# Altium schematic sheet SCH2_Power.SchDoc: Airsoft FAN Controller
size A4
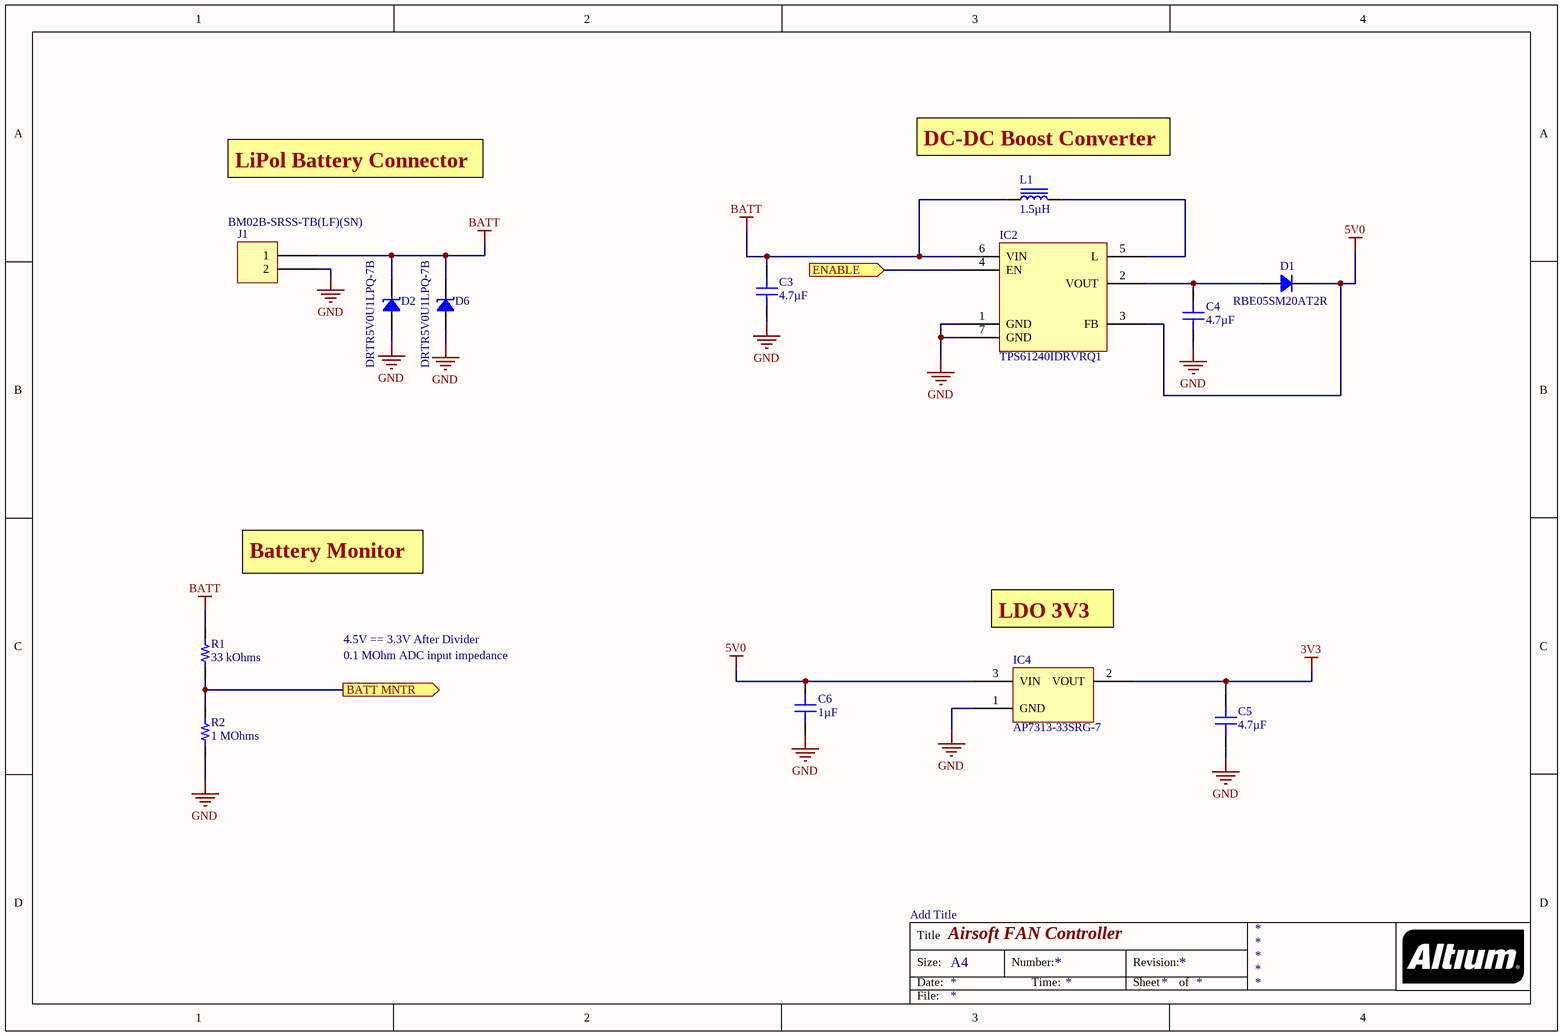
[diagram p0: SCH2_Power.SchDoc]

## Parts
C3  4.7µF  [CAP 0402_1005]
C4  4.7µF  [CAP 0402_1005]
C5  4.7µF  [CAP 0402_1005]
C6  1µF  [CAP 0402_1005]
D1  RBE05SM20AT2R  [SOD-523]
D2  DRTR5V0U1LPQ-7B  [0402]
D6  DRTR5V0U1LPQ-7B  [0402]
IC2  TPS61240IDRVRQ1  [TI WSON-6 DRV0006D 2x2MM]
IC4  AP7313-33SRG-7  [DIODES SOT-23-3]
J1  BM02B-SRSS-TB(LF)(SN)  [MOLX-53398-0271_V]
L1  1.5µH  [IND 0806_2016]
R1  33 kOhms  [RES 0402_1005]
R2  1 MOhms  [RES 0402_1005]

## Ports
BATT MNTR (out), ENABLE (in)

## Nets
3V3: C5.2 IC4.2(VOUT)
5V0: C6.2 D1.2 IC2.3(FB) IC4.3(VIN)
BATT: C3.2 D2.2 D6.2 IC2.6(VIN) J1.1 L1.1 R1.2
GND: C3.1 C4.1 C5.1 C6.1 D2.1 D6.1 IC2.1(GND) IC2.7(GND) IC4.1(GND) J1.2 R2.1
BATT MNTR: R1.1 R2.2 ; port BATT MNTR
ENABLE: IC2.4(EN) ; port ENABLE
NetC4_2: C4.2 D1.1 IC2.2(VOUT)
NetIC2_5: IC2.5(L) L1.2

## Notes on the sheet
- LiPol Battery Connector
- (near L1) DC-DC Boost Converter 5V0
- Battery Monitor
- 4.5V == 3.3V After Divider
- LDO 3V3
- 0.1 MOhm ADC input impedance
- Add Title
- Title
- Size:
- Date:
- A4
- Number:
- Time:
- Revision:
- Sheet
- of
- File:

## Library data of the parts
C3-C5 = C1005X5R1A475K050BC: CAP CER 4.7UF 10V X5R 0402; Manufacturer: TDK Corporation; Tolerance: ±10%; Part Number: C1005X5R1A475K050BC; Value: 4.7µF; Applications: General Purpose; Capacitance: 4.7µF; ComponentLink1Description: Datasheet; ComponentLink1URL: https://product.tdk.com/info/en/catalog/datasheets/mlcc_commercial_general_en.pdf?ref_disty=digikey; ComponentLink2Description: DigiKey Link; ComponentLink2URL: http://digikey.com/product-detail/en/tdk-corporation/C1005X5R1A475K050BC/445-13820-1-ND/3955486; Device Package: 0402 (1005 Metric); Features: Low ESL; LastUpdated: 9/2/2020 1:02:25 AM; Lifecycle Status: Active; Minimum Order: 1; Mounting Type: Surface Mount, MLCC; Operating Temperature: -55°C ~ 85°C; Package / Case: 0402 (1005 Metric); Packaging: TapeAndReel; PartId: 1759; Part Status: Active; Price: 0.10; Series: C; Size / Dimension: 0.039" L x 0.020" W (1.00mm x 0.50mm); Supplier 1: DigiKey; Supplier Part Number 1: 445-13820-1-ND; Temperature Coefficient: X5R; Thickness (Max): 0.022" (0.55mm); Voltage - Rated: 10V
C6 = JMK105C6105KV-F: CAP CER 1UF 6.3V X6S 0402; Manufacturer: Taiyo Yuden; Tolerance: ±10%; Part Number: JMK105C6105KV-F; Value: 1µF; Applications: General Purpose; Capacitance: 1µF; ComponentLink1Description: Datasheet; ComponentLink1URL: https://www.yuden.co.jp/productdata/catalog/mlcc01_e.pdf; ComponentLink2Description: DigiKey Link; ComponentLink2URL: http://digikey.com/product-detail/en/taiyo-yuden/JMK105C6105KV-F/587-3381-1-ND/4157200; Device Package: 0402 (1005 Metric); LastUpdated: 9/2/2020 1:01:39 AM; Lifecycle Status: Active; Minimum Order: 1; Mounting Type: Surface Mount, MLCC; Operating Temperature: -55°C ~ 105°C; Package / Case: 0402 (1005 Metric); Packaging: TapeAndReel; PartId: 12563; Part Status: Active; Price: 0.01; Series: M; Size / Dimension: 0.039" L x 0.020" W (1.00mm x 0.50mm); Supplier 1: DigiKey; Supplier Part Number 1: 587-3381-1-ND; Temperature Coefficient: X6S; Thickness (Max): 0.022" (0.55mm); Voltage - Rated: 6.3V
D1 = RBE05SM20AT2R: DIODE SCHOTTKY 20V 500MA EMD2; Manufacturer: Rohm Semiconductor; Current - Reverse Leakage @ Vr: 150µA @ 20V; Speed: Fast Recovery =< 500ns, > 200mA (Io); Voltage - Forward (Vf) (Max) @ If: 530mV @ 500mA; Part Number: RBE05SM20AT2R; ComponentLink1Description: Datasheet; ComponentLink1URL: https://www.rohm.com/datasheet/RBE05SM20A/rbe05sm20at2r-e; ComponentLink2Description: DigiKey Link; ComponentLink2URL: http://digikey.com/product-detail/en/rohm-semiconductor/RBE05SM20AT2R/RBE05SM20AT2RTR-ND/5721257; Current - Average Rectified (Io): 500mA; Diode Type: Schottky; LastUpdated: 9/2/2020 1:23:19 AM; Lifecycle Status: Active; Minimum Order: 0; Mounting Type: Surface Mount; Operating Temperature - Junction: 150°C (Max); Package / Case: SC-79, SOD-523; Packaging: TapeAndReel; PartId: 2802; Part Status: Active; Price: 0.05; Series: -; Supplier 1: DigiKey; Supplier Part Number 1: RBE05SM20AT2RTR-ND; Supplier Device Package: EMD2; Voltage - DC Reverse (Vr) (Max): 20V
D2 D6 = DRTR5V0U1LPQ-7B: DATALINE PROTECT PP X1-DFN1006-2; Manufacturer: Diodes Incorporated; Capacitance @ Frequency: 1pF @ 1MHz; Current - Peak Pulse (10/1000µs): 5A (8/20µs); Power Line Protection: No; Type: Zener; Unidirectional Channels: 1; Voltage - Breakdown (Min): 6V; Voltage - Clamping (Max) @ Ipp: 10V; Voltage - Reverse Standoff (Typ): 5.5V (Max); Part Number: DRTR5V0U1LPQ-7B; Applications: Automotive; ComponentLink1Description: Datasheet; ComponentLink1URL: https://www.diodes.com/assets/Datasheets/DRTR5V0U1LPQ.pdf; ComponentLink2Description: DigiKey Link; ComponentLink2URL: http://digikey.com/product-detail/en/diodes-incorporated/DRTR5V0U1LPQ-7B/31-DRTR5V0U1LPQ-7BCT-ND/10674185; Device Package: 0402 (1006 Metric); LastUpdated: 9/2/2020 1:28:45 AM; Lifecycle Status: Active; Minimum Order: 1; Mounting Type: Surface Mount; Operating Temperature: -55°C ~ 150°C (TJ); Package / Case: 0402 (1006 Metric); Packaging: Unknown; PartId: 10375; Part Status: Active; Price: 0.04; Series: Automotive, AEC-Q101; Supplier 1: DigiKey; Supplier Part Number 1: 31-DRTR5V0U1LPQ-7BCT-ND; Supplier Device Package: X1-DFN1006-2
IC2 = TPS61240IDRVRQ1: IC REG BOOST 5V 500MA 6SON; Manufacturer: Texas Instruments; Current - Output: 500mA (Switch); Frequency - Switching: 3.5MHz; Function: Step-Up; Number of Outputs: 1; Output Configuration: Positive; Output Type: Fixed; Synchronous Rectifier: Yes; Voltage - Input (Max): 5.5V; Voltage - Input (Min): 2.3V; Part Number: TPS61240IDRVRQ1; ComponentLink1Description: Datasheet; ComponentLink1URL: http://www.ti.com/general/docs/suppproductinfo.tsp?distId=10&gotoUrl=http%3A%2F%2Fwww.ti.com%2Flit%2Fgpn%2Ftps61240-q1; ComponentLink2Description: DigiKey Link; ComponentLink2URL: http://digikey.com/product-detail/en/texas-instruments/TPS61240IDRVRQ1/296-28184-1-ND/2522312; LastUpdated: 9/13/2020 11:04:11 AM; Lifecycle Status: Active; Minimum Order: 1; Mounting Type: Surface Mount; Operating Temperature: -40°C ~ 85°C (TA); Package / Case: 6-WDFN Exposed Pad; Packaging: TapeAndReel; Part Status: Active; Price: 0.73; Series: Automotive, AEC-Q100; Supplier 1: DigiKey; Supplier Part Number 1: 296-28184-1-ND; Supplier Device Package: 6-SON (2x2); Topology: Boost; Voltage - Output (Min/Fixed): 5V
IC4 = AP7313-33SRG-7: IC REG LIN 3.3V 150MA SOT23R-3; Manufacturer: Diodes Incorporated; Current - Quiescent (Iq): 75µA; Current - Supply (Max): 85µA; Number of Regulators: 1; Output Configuration: Positive; Output Type: Fixed; Protection Features: Over Current, Over Temperature, Short Circuit; PSRR: 65dB (100Hz); Voltage Dropout (Max): 0.3V @ 150mA; Voltage - Input (Max): 6V; Part Number: AP7313-33SRG-7; ComponentLink1Description: Datasheet; ComponentLink1URL: https://www.diodes.com/assets/Datasheets/AP7313.pdf; ComponentLink2Description: DigiKey Link; ComponentLink2URL: http://digikey.com/product-detail/en/diodes-incorporated/AP7313-33SRG-7/AP7313-33SRG-7DICT-ND/2270841; Current - Output: 150mA; LastUpdated: 9/2/2020 1:24:50 AM; Lifecycle Status: Active; Minimum Order: 1; Mounting Type: Surface Mount; Operating Temperature: -40°C ~ 85°C; Package / Case: TO-236-3, SC-59, SOT-23-3; Packaging: TapeAndReel; Part Status: Active; Price: 0.09; Series: -; Supplier 1: DigiKey; Supplier Part Number 1: AP7313-33SRG-7DICT-ND; Supplier Device Package: SOT-23R-3; Voltage - Output (Min/Fixed): 3.3V
J1 = BM02B-SRSS-TB(LF)(SN): CONN HEADER SMD 2POS 1MM; Manufacturer: JST Sales America Inc.; Current Rating (Amps): 0.7A; Material Flammability Rating: UL94 V-0; Number of Positions: 2; Number of Positions Loaded: All; Pitch - Mating: 0.039" (1.00mm); Shrouding: Shrouded - 4 Wall; Style: Board to Cable/Wire; Voltage Rating: 50V; Part Number: BM02B-SRSS-TB(LF)(SN); ComponentLink1Description: Datasheet; ComponentLink1URL: http://www.jst-mfg.com/product/pdf/eng/eSR.pdf; ComponentLink2Description: DigiKey Link; ComponentLink2URL: http://digikey.com/product-detail/en/jst-sales-america-inc/BM02B-SRSS-TB-LF-SN/455-1788-1-ND/926859; Connector Type: Header; Contact Finish - Mating: Tin; Contact Finish - Post: Tin; Contact Material: Copper Alloy; Contact Shape: Square; Contact Type: Male Pin; Fastening Type: Push-Pull; Features: Solder Retention; Insulation Color: Natural; Insulation Height: 0.167" (4.25mm); Insulation Material: Polyamide (PA), Nylon; LastUpdated: 1/12/2020 10:11:04 PM; Lifecycle Status: Active; Minimum Order: 1; Mounting Type: Surface Mount; Number of Rows: 1; Operating Temperature: -25°C ~ 85°C; Packaging: TapeAndReel; PartId: 12; Part Status: Active; Price: 0.22; Series: SR; Supplier 1: DigiKey; Supplier Part Number 1: 455-1788-1-ND; Termination: Solder
L1 = LQH2MCN1R5M52L: FIXED IND 1.5UH 540MA 330 MOHM; Manufacturer: Murata Electronics; DC Resistance (DCR): 429mOhm Max; Frequency - Self Resonant: 165MHz; Inductance Frequency - Test: 1MHz; Material - Core: Ferrite; Shielding: Unshielded; Tolerance: ±20%; Type: Wirewound; Part Number: LQH2MCN1R5M52L; ComponentLink1Description: Datasheet; ComponentLink1URL: https://search.murata.co.jp/Ceramy/image/img/P02/JELF243A-0060.pdf; ComponentLink2Description: DigiKey Link; ComponentLink2URL: http://digikey.com/product-detail/en/murata-electronics/LQH2MCN1R5M52L/490-4985-1-ND/1788283; Current Rating (Amps): 540mA; Device Package: 0806 (2016 Metric); Height - Seated (Max): 0.037" (0.95mm); Inductance: 1.5µH; LastUpdated: 9/2/2020 1:24:34 AM; Lifecycle Status: Active; Minimum Order: 1; Mounting Type: Surface Mount; Operating Temperature: -40°C ~ 85°C; Package / Case: 0806 (2016 Metric); Packaging: TapeAndReel; PartId: 3084; Part Status: Active; Price: 0.14; Series: LQH2; Size / Dimension: 0.079" L x 0.063" W (2.00mm x 1.60mm); Supplier 1: DigiKey; Supplier Part Number 1: 490-4985-1-ND; Supplier Device Package: 0806 (2016 Metric); Value: 1.5µH
R1 = RR0510P-333-D: RES SMD 33K OHM 0.5% 1/16W 0402; Manufacturer: Susumu; Power (Watts): 0.063W, 1/16W; Temperature Coefficient: ±25ppm/°C; Part Number: RR0510P-333-D; Value: 33 kOhms; ComponentLink1Description: Datasheet; ComponentLink1URL: http://www.susumu.co.jp/common/pdf/n_catalog_partition05_en.pdf; ComponentLink2Description: DigiKey Link; ComponentLink2URL: http://digikey.com/product-detail/en/susumu/RR0510P-333-D/RR05P33.0KDCT-ND/432971; Composition: Thin Film; Device Package: 0402 (1005 Metric); Height - Seated (Max): 0.016" (0.40mm); LastUpdated: 9/2/2020 1:08:09 AM; Lifecycle Status: Active; Minimum Order: 1; Number of Terminations: 2; Operating Temperature: -55°C ~ 125°C; Package / Case: 0402 (1005 Metric); Packaging: TapeAndReel; PartId: 3295; Part Status: Active; Price: 0.01; Resistance: 33 kOhms; Series: RR; Size / Dimension: 0.039" L x 0.020" W (1.00mm x 0.50mm); Supplier 1: DigiKey; Supplier Part Number 1: RR05P33.0KDCT-ND; Tolerance: ±0.5%
R2 = CRCW04021M00FKTD: RES SMD 1M OHM 1% 1/16W 0402; Manufacturer: Vishay Dale; Power (Watts): 0.063W, 1/16W; Temperature Coefficient: ±100ppm/°C; Part Number: CRCW04021M00FKTD; Value: 1 MOhms; ComponentLink1Description: Datasheet; ComponentLink1URL: http://www.vishay.com/docs/20008/dcrcw.pdf; ComponentLink2Description: DigiKey Link; ComponentLink2URL: http://digikey.com/product-detail/en/vishay-dale/CRCW04021M00FKTD/541-CRCW04021M00FKTDCT-ND/11500836; Composition: Thick Film; Device Package: 0402 (1005 Metric); Features: Automotive AEC-Q200; LastUpdated: 9/2/2020 1:07:22 AM; Lifecycle Status: Active; Minimum Order: 1; Number of Terminations: 2; Operating Temperature: -55°C ~ 155°C; Package / Case: 0402 (1005 Metric); Packaging: TapeAndReel; PartId: 56877; Price: 0.01; Ratings: AEC-Q200; Resistance: 1 MOhms; Series: CRCW; Supplier 1: DigiKey; Supplier Part Number 1: 541-CRCW04021M00FKTDCT-ND; Supplier Device Package: 0402; Tolerance: ±1%